# EAGLE design slave (EAGLE 9.5.1)
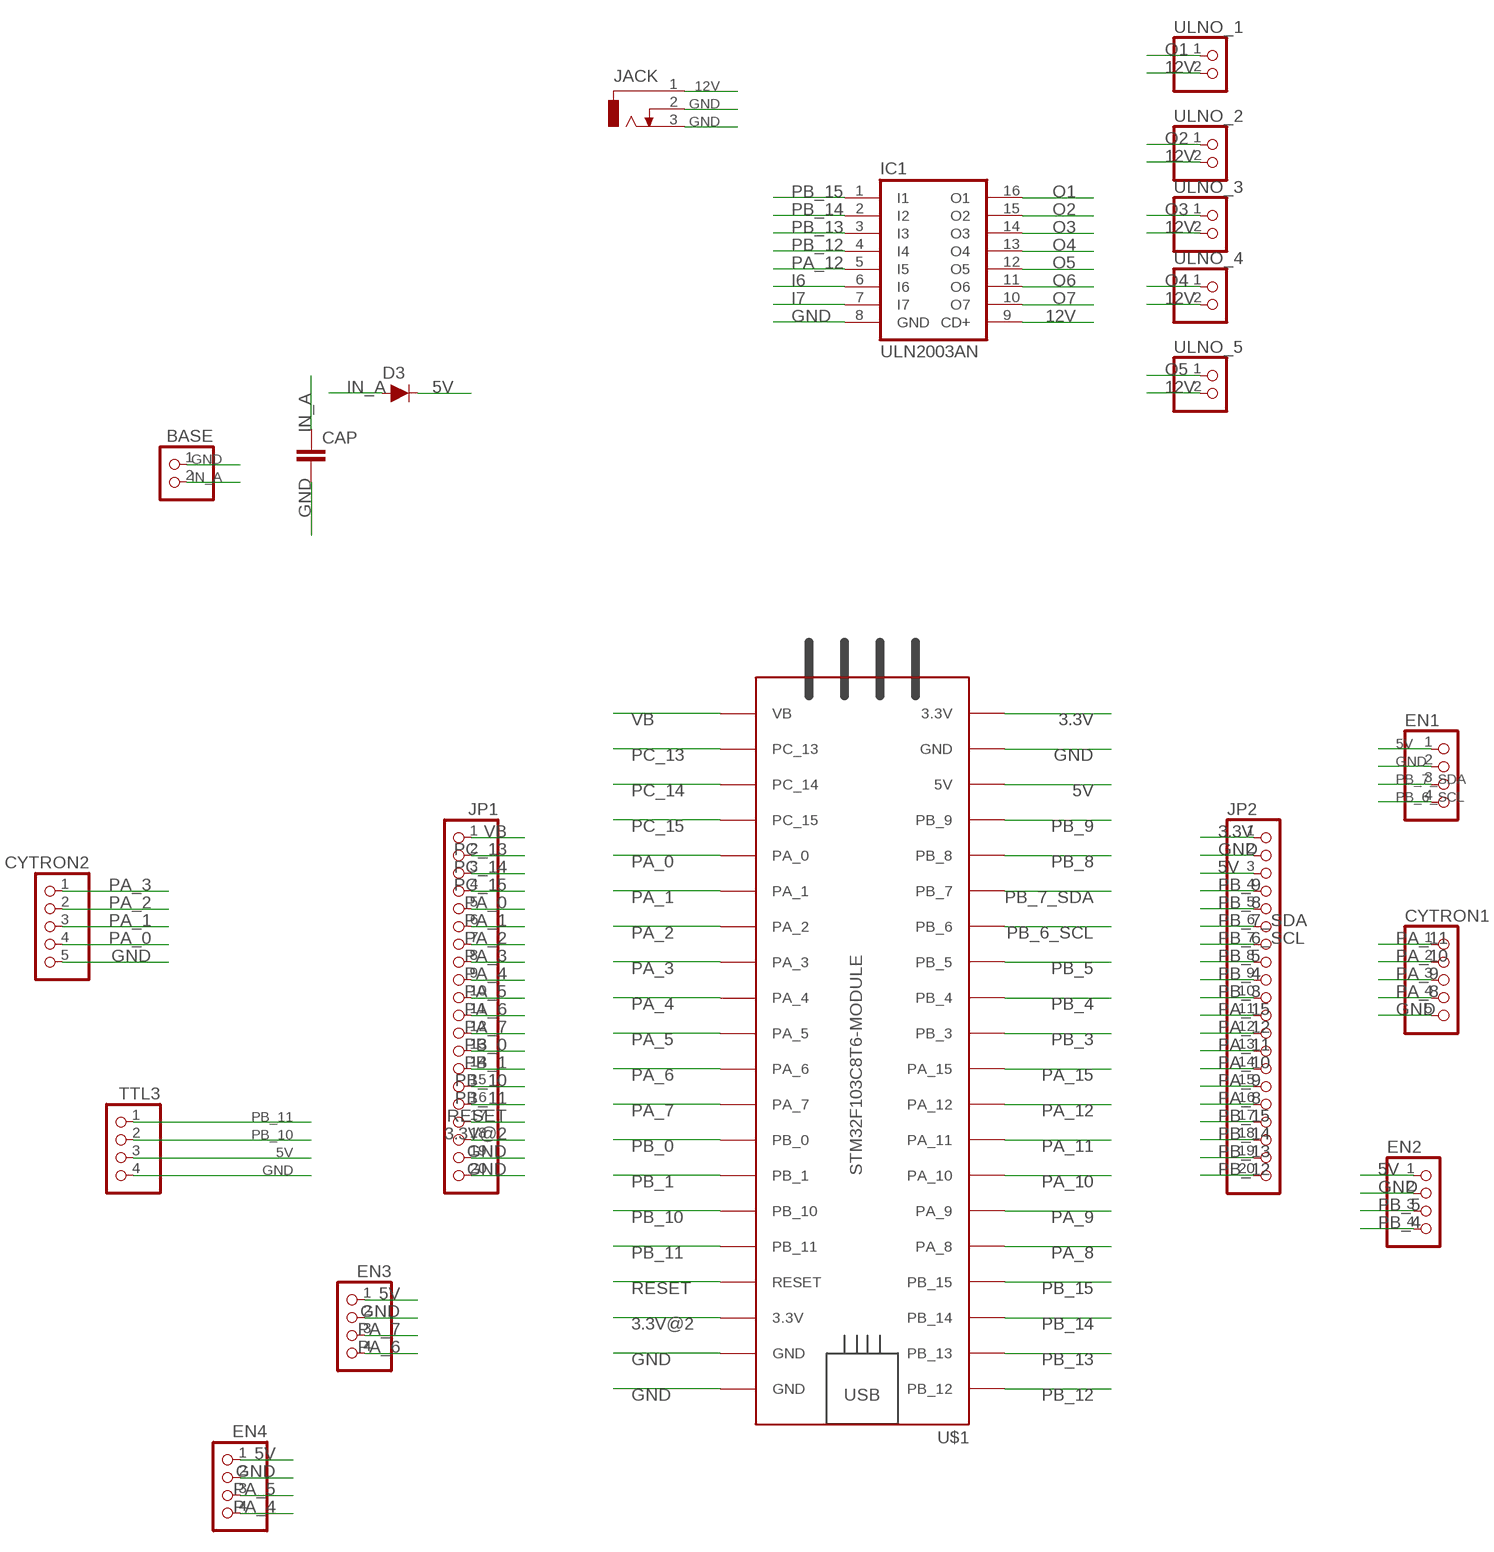
[diagram p0: schematic, sheet 1]

## Parts
BASE  PINHD-2_DATA  [1X02_DATA]
CAP  CAPACITOR  [C025-025X050]
CYTRON1  PINHD-5_DATA  [1X05_DATA]
CYTRON2  PINHD-5_DATA  [1X05_DATA]
D3  200mA/100V/1V  DIODE(1A)-1N4148  [DIODE-1N4148]
EN1  PINHD-4_DATA  [1X04_DATA]
EN2  PINHD-4_DATA  [1X04_DATA]
EN3  PINHD-4_DATA  [1X04_DATA]
EN4  PINHD-4_DATA  [1X04_DATA]
IC1  ULN2003AN  [DIL16]
JACK  CON_JACK  [DCJ0303]
JP1  PINHD-1X20  [1X20]
JP2  PINHD-1X20  [1X20]
TTL3  PINHD-4_DATA  [1X04_DATA]
U$1  STM32F103C8T6-MODULE  [STM32F103C8T6-MODULE]
ULNO_1  PINHD-2_DATA  [1X02_DATA]
ULNO_2  PINHD-2_DATA  [1X02_DATA]
ULNO_3  PINHD-2_DATA  [1X02_DATA]
ULNO_4  PINHD-2_DATA  [1X02_DATA]
ULNO_5  PINHD-2_DATA  [1X02_DATA]

## Nets
3.3V: JP2.1 U$1.3.3V_1(3.3V)
3.3V@2: JP1.18 U$1.3.3V_2(3.3V)
5V: D3.C EN1.1 EN2.1 EN3.1 EN4.1 JP2.3 TTL3.3 U$1.5V
12V: IC1.9(CD+) JACK.1 ULNO_1.2 ULNO_2.2 ULNO_3.2 ULNO_4.2 ULNO_5.2
GND: BASE.1 CAP.2 CYTRON1.5 CYTRON2.5 EN1.2 EN2.2 EN3.2 EN4.2 IC1.8(GND) JACK.2 JACK.3 JP1.19 JP1.20 JP2.2 TTL3.4 U$1.GND_1(GND) U$1.GND_2(GND) U$1.GND_3(GND)
I6: IC1.6(I6)
I7: IC1.7(I7)
IN_A: BASE.2 CAP.1 D3.A
O1: IC1.16(O1) ULNO_1.1
O2: IC1.15(O2) ULNO_2.1
O3: IC1.14(O3) ULNO_3.1
O4: IC1.13(O4) ULNO_4.1
O5: IC1.12(O5) ULNO_5.1
O6: IC1.11(O6)
O7: IC1.10(O7)
PA_0: CYTRON2.4 JP1.5 U$1.PA_0
PA_1: CYTRON2.3 JP1.6 U$1.PA_1
PA_2: CYTRON2.2 JP1.7 U$1.PA_2
PA_3: CYTRON2.1 JP1.8 U$1.PA_3
PA_4: EN4.4 JP1.9 U$1.PA_4
PA_5: EN4.3 JP1.10 U$1.PA_5
PA_6: EN3.4 JP1.11 U$1.PA_6
PA_7: EN3.3 JP1.12 U$1.PA_7
PA_8: CYTRON1.4 JP2.16 U$1.PA_8
PA_9: CYTRON1.3 JP2.15 U$1.PA_9
PA_10: CYTRON1.2 JP2.14 U$1.PA_10
PA_11: CYTRON1.1 JP2.13 U$1.PA_11
PA_12: IC1.5(I5) JP2.12 U$1.PA_12
PA_15: JP2.11 U$1.PA_15
PB_0: JP1.13 U$1.PB_0
PB_1: JP1.14 U$1.PB_1
PB_3: JP2.10 U$1.PB_3
PB_4: EN2.4 JP2.9 U$1.PB_4
PB_5: EN2.3 JP2.8 U$1.PB_5
PB_6_SCL: EN1.4 JP2.7 U$1.PB_6
PB_7_SDA: EN1.3 JP2.6 U$1.PB_7
PB_8: JP2.5 U$1.PB_8
PB_9: JP2.4 U$1.PB_9
PB_10: JP1.15 TTL3.2 U$1.PB_10
PB_11: JP1.16 TTL3.1 U$1.PB_11
PB_12: IC1.4(I4) JP2.20 U$1.PB_12
PB_13: IC1.3(I3) JP2.19 U$1.PB_13
PB_14: IC1.2(I2) JP2.18 U$1.PB_14
PB_15: IC1.1(I1) JP2.17 U$1.PB_15
PC_13: JP1.2 U$1.PC_13
PC_14: JP1.3 U$1.PC_14
PC_15: JP1.4 U$1.PC_15
RESET: JP1.17 U$1.RESET
VB: JP1.1 U$1.VB

## Library data of the parts
BASE ULNO_1-ULNO_5 = MIA_LIBRARY-2-2-2:PINHD-2_DATA: PIN HEADER
CAP = MIA_LIBRARY-2-2-2:CAPACITOR
CYTRON1 CYTRON2 = MIA_LIBRARY-2-2-2:PINHD-5_DATA: PIN HEADER
D3 = MIA_LIBRARY-2-2-2:DIODE(1A): Diode These are standard reverse protection diodes and small signal diodes. SparkFun Products: SparkFun SparkPunk Sound Kit <https://www.sparkfun.com/products/11177> SparkFun ESP8266 Thing <https://www.sparkfun.com/products/13231>; PROD_ID: DIO-08378
EN1-EN4 TTL3 = MIA_LIBRARY-2-2-2:PINHD-4_DATA: PIN HEADER
IC1 = MIA_LIBRARY-2-2-2:ULN2003A: DRIVER ARRAY
JACK = MIA_LIBRARY-2-2-2:CON_JACK: DC POWER JACK Source: DCJ0303.pdf; OC_FARNELL: unknown; OC_NEWARK: unknown
JP1 JP2 = MIA_LIBRARY-2-2-2:PINHD-1X20: PIN HEADER
U$1 = MIA_LIBRARY-2-2-2:STM32F103C8T6-MODULE: STM32F103C8T6 module with ARM Cortex-3, 20kB SRAM, 64kB Flash, 72MHz

## Board
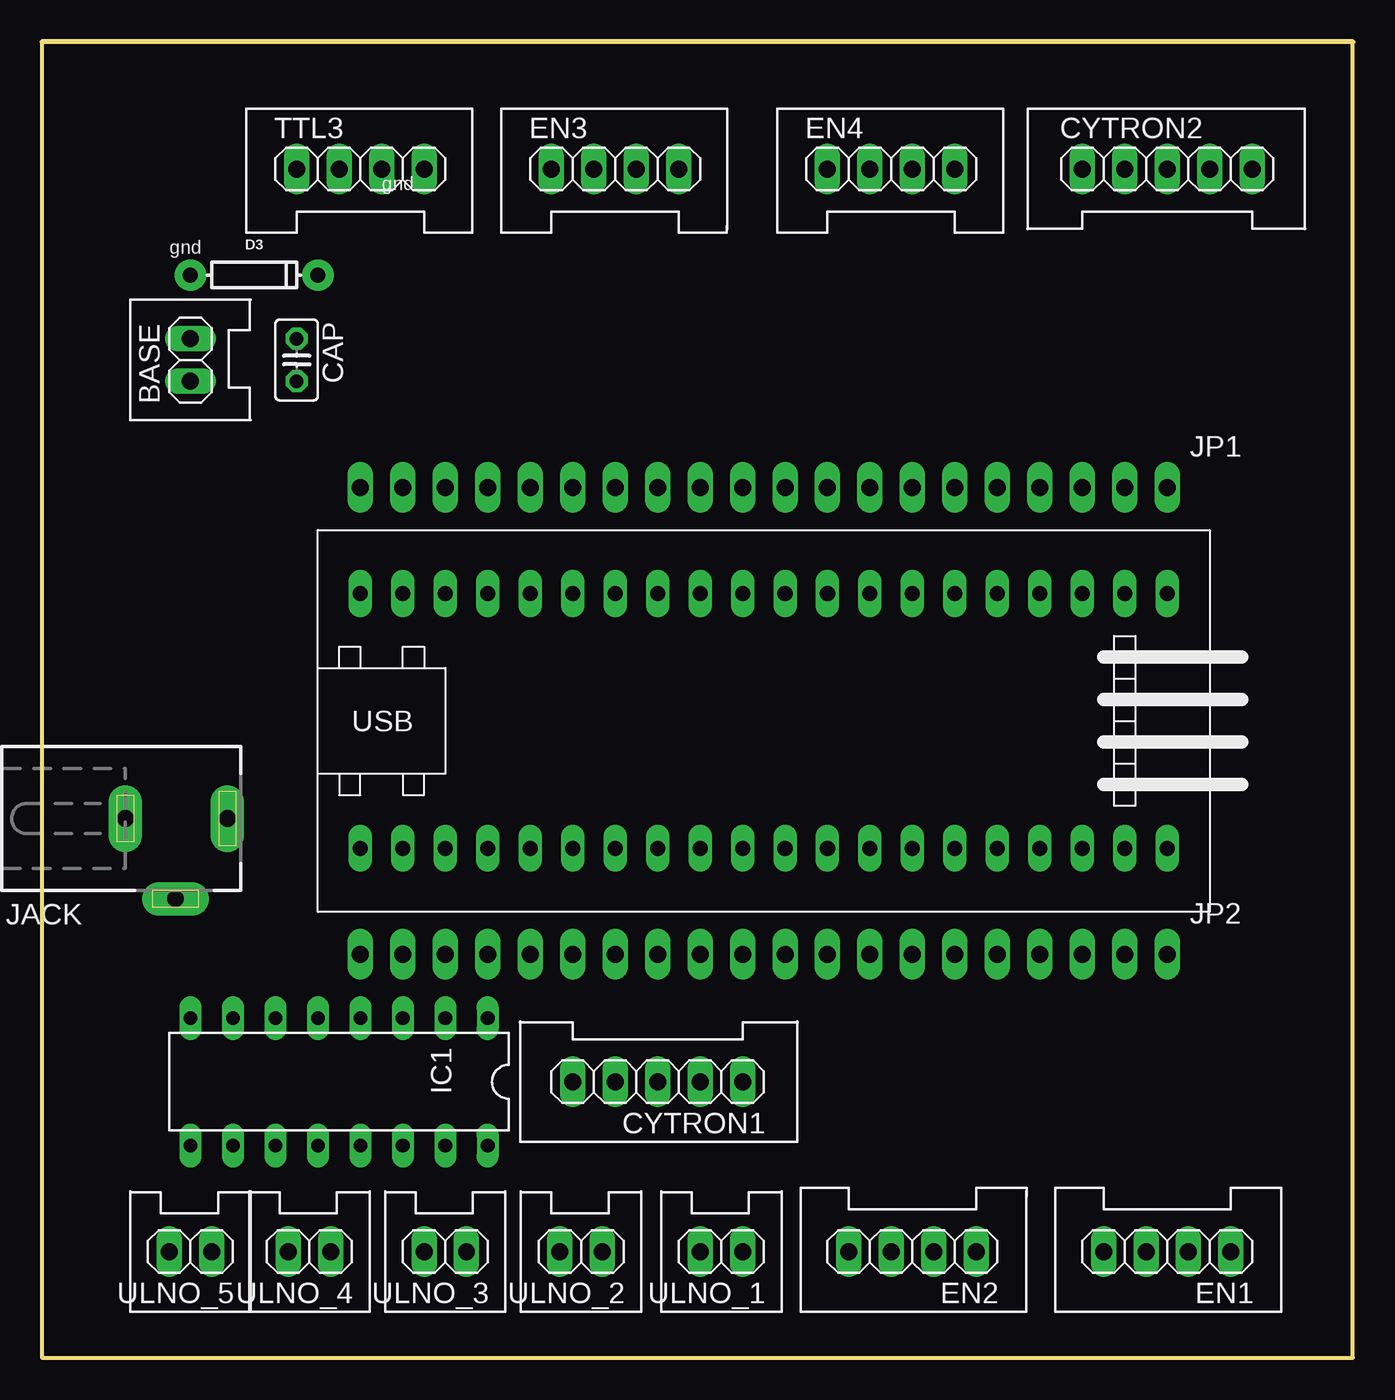
[diagram p1: board, top side]
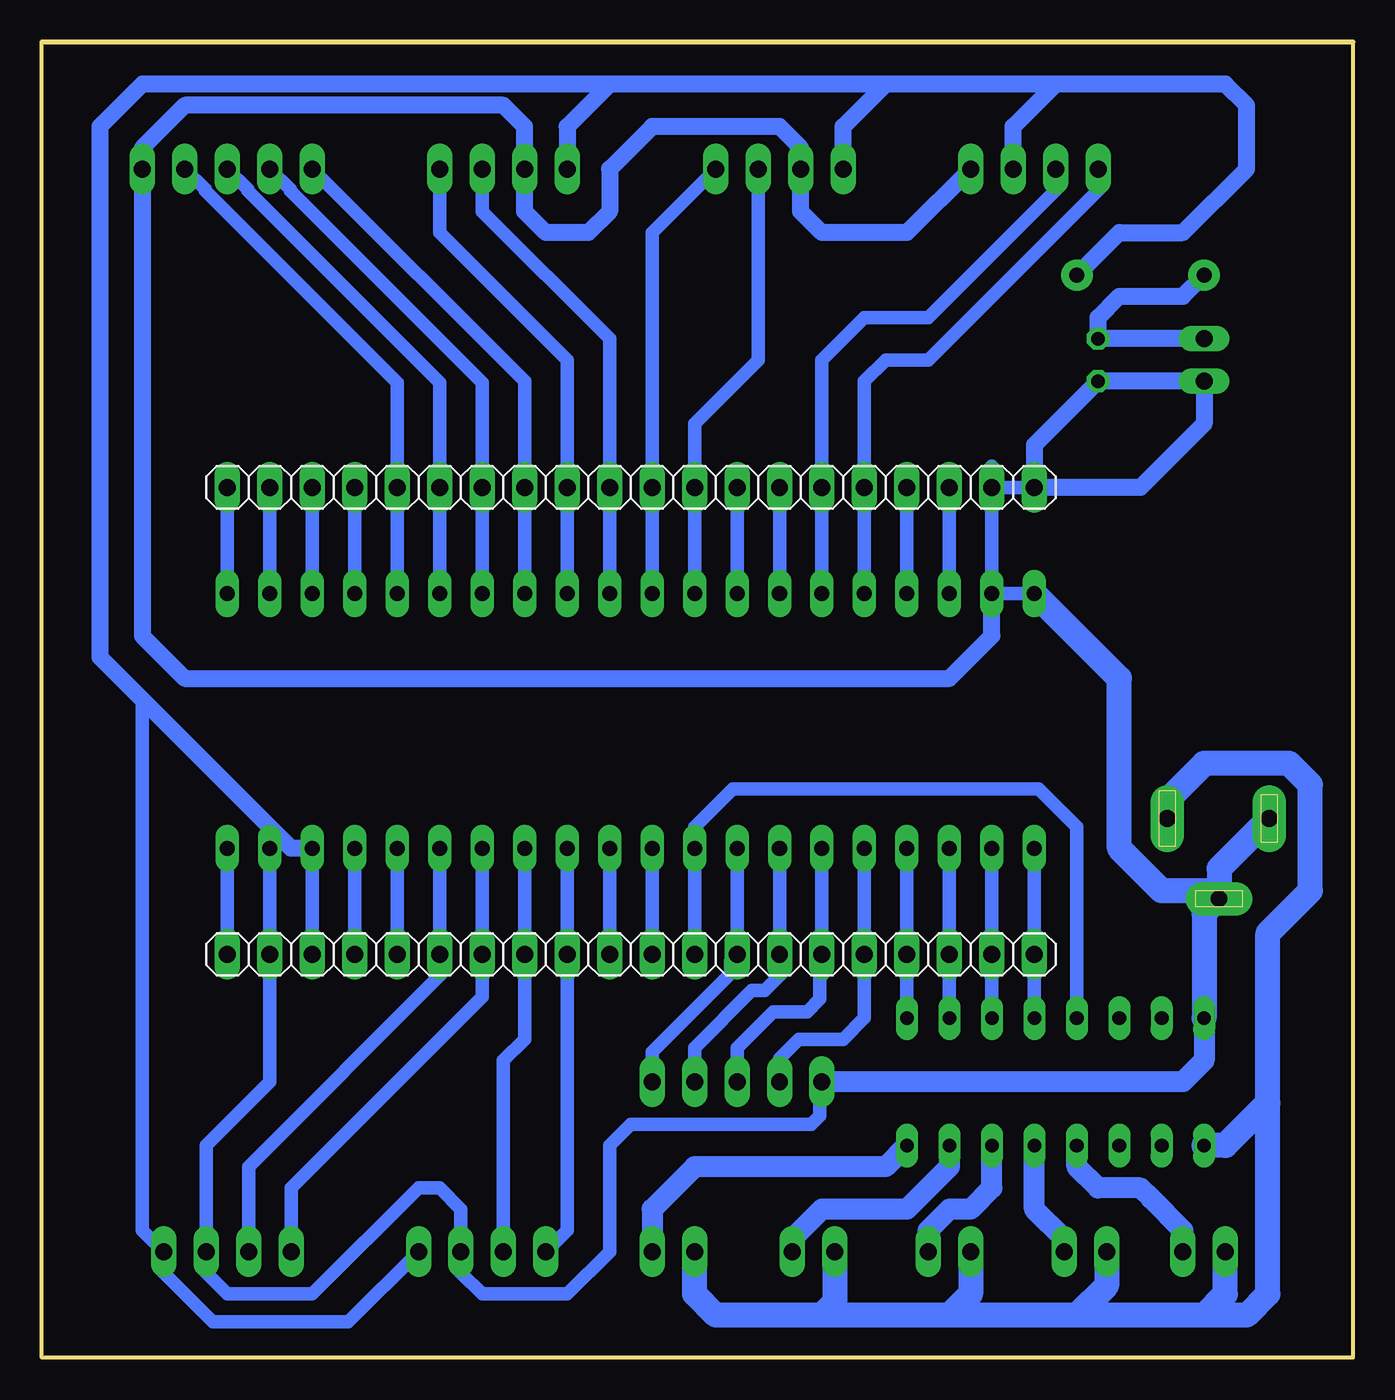
[diagram p2: board, bottom side, seen from below]

Size 78.41 x 78.73 mm. Coordinates in mm from the lower left corner, seen from the top.
Outline: 0,0 78.41,0 78.41,78.73 0,78.73 0,0
Copper layers (1*16): Top 0.035mm / dielectric 1.5mm / Bottom 0.035mm
Design rules "default": minimum track width 6mil, minimum drill 0.35mm, track to track 6mil, track to pad 6mil, pad to pad 6mil, via to via 6mil, smd to smd 6mil, copper to edge 40mil, drill to drill 6mil, minimum pad ring 10mil, minimum via ring 8mil, stop-mask expansion 4mil, vias tented up to drill 0mil, thermal gap 10mil

### Footprints (pad centres in the part's own frame; a part is rotated, then mirrored left to right if it is on the bottom)
1X02_DATA = drill 1.016 long: 1 -1.27,0; 2 1.27,0
C025-025X050 = drill 0.813 octagon: 1 -1.27,0; 2 1.27,0
1X05_DATA = drill 1.016 long: 1 -5.08,0; 2 -2.54,0; 3 0,0; 4 2.54,0; 5 5.08,0
DIODE-1N4148 = drill 0.9 pad 1.88: A -3.81,0; C 3.81,0
1X04_DATA = drill 1.016 long: 1 -3.81,0; 2 -1.27,0; 3 1.27,0; 4 3.81,0
DIL16 = drill 0.813 long: 1 -8.89,-3.81; 2 -6.35,-3.81; 3 -3.81,-3.81; 4 -1.27,-3.81; 5 1.27,-3.81; 6 3.81,-3.81; 7 6.35,-3.81; 8 8.89,-3.81; 9 8.89,3.81; 10 6.35,3.81; 11 3.81,3.81; 12 1.27,3.81; 13 -1.27,3.81; 14 -3.81,3.81; 15 -6.35,3.81; 16 -8.89,3.81
DCJ0303 = drill 1 pad 2 long: 1 0,3.1; 2 4.8,0; 3 0,-3
1X20 = drill 1.016 long: 1 -24.13,0; 2 -21.59,0; 3 -19.05,0; 4 -16.51,0; 5 -13.97,0; 6 -11.43,0; 7 -8.89,0; 8 -6.35,0; 9 -3.81,0; 10 -1.27,0; 11 1.27,0; 12 3.81,0; 13 6.35,0; 14 8.89,0; 15 11.43,0; 16 13.97,0; 17 16.51,0; 18 19.05,0; 19 21.59,0; 20 24.13,0
STM32F103C8T6-MODULE = drill 0.9 long: 3.3V_1 25.4,-7.62; 3.3V_2 -17.78,7.62; 5V 20.32,-7.62; GND_1 22.86,-7.62; GND_2 -20.32,7.62; GND_3 -22.86,7.62; PA_0 15.24,7.62; PA_1 12.7,7.62; PA_2 10.16,7.62; PA_3 7.62,7.62; PA_4 5.08,7.62; PA_5 2.54,7.62; PA_6 0,7.62; PA_7 -2.54,7.62; PA_8 -12.7,-7.62; PA_9 -10.16,-7.62; PA_10 -7.62,-7.62; PA_11 -5.08,-7.62; PA_12 -2.54,-7.62; PA_15 0,-7.62; PB_0 -5.08,7.62; PB_1 -7.62,7.62; PB_3 2.54,-7.62; PB_4 5.08,-7.62; PB_5 7.62,-7.62; PB_6 10.16,-7.62; PB_7 12.7,-7.62; PB_8 15.24,-7.62; PB_9 17.78,-7.62; PB_10 -10.16,7.62; PB_11 -12.7,7.62; PB_12 -22.86,-7.62; PB_13 -20.32,-7.62; PB_14 -17.78,-7.62; PB_15 -15.24,-7.62; PC_13 22.86,7.62; PC_14 20.32,7.62; PC_15 17.78,7.62; RESET -15.24,7.62; VB 25.4,7.62

### Placement (x,y rotation side)
BASE  8.89,59.69 90 top
CAP  15.24,59.69 270 top
CYTRON1  36.83,16.51 180 top
CYTRON2  67.31,71.12 0 top
D3  12.7,64.77 0 top
EN1  67.31,6.35 180 top
EN2  52.07,6.35 180 top
EN3  34.29,71.12 0 top
EN4  50.8,71.12 0 top
IC1  17.78,16.51 180 top
JACK  8,32.26 270 top
JP1  43.18,52.07 0 bottom
JP2  43.18,24.13 0 bottom
TTL3  19.05,71.12 0 top
U$1  41.91,38.1 0 top
ULNO_1  40.64,6.35 180 top
ULNO_2  32.26,6.35 180 top
ULNO_3  24.13,6.35 180 top
ULNO_4  16,6.35 180 top
ULNO_5  8.89,6.35 180 top

### Tracks (layer width: path | path; a pad name or v marks a point on that pad's centre or on a via)
3.3V
  Bottom 0.813: U$1.3.3V_1 JP2.1
3.3V@2
  Bottom 0.813: U$1.3.3V_2 JP1.18
5V
  Bottom 0.813: U$1.5V JP2.3 | EN2.1 60.07,2.16 68.2,2.16 71.12,5.08 EN1.1 72.39,7.62 72.39,39.37
  Bottom 1.016: 44.45,76.2 46.99,73.66 EN4.1 | D3.C 13.97,67.31 10.16,67.31 6.35,71.12 6.35,74.93 7.62,76.2 17.78,76.2 | 17.78,76.2 27.94,76.2 | 27.94,76.2 44.45,76.2 | TTL3.3 20.32,73.66 17.78,76.2 | EN3.1 30.48,73.66 27.94,76.2 | 44.45,76.2 72.39,76.2 74.93,73.66 74.93,41.91 72.39,39.37 63.5,30.48 U$1.5V
12V
  Bottom 1.5: 5.08,15.24 7.62,12.7 IC1.9 | 5.08,15.24 5.08,3.81 6.35,2.54 8.89,2.54 | 8.89,2.54 16.51,2.54 | 16.51,2.54 24.13,2.54 | 24.13,2.54 31.75,2.54 | 31.75,2.54 38.1,2.54 39.37,3.81 ULNO_1.2 | 8.89,2.54 7.62,3.81 ULNO_5.2 | ULNO_4.2 14.73,4.32 16.51,2.54 | ULNO_3.2 22.86,3.81 24.13,2.54 | ULNO_2.2 30.99,3.3 31.75,2.54 | JACK.1 11.1,33.35 8.89,35.56 3.81,35.56 2.54,34.29 2.54,27.94 5.08,25.4 5.08,15.24
GND
  Bottom 0.813: U$1.GND_1 JP2.2 64.77,16.51 68.58,12.7 EN1.2 68.58,5.08 67.31,3.81 62.23,3.81 55.88,10.16 54.61,10.16 53.34,8.89 EN2.2 53.34,5.08 52.07,3.81 46.99,3.81 44.45,6.35 44.45,12.7 43.18,13.97 32.38,13.97 31.88,14.48 31.88,16.38 CYTRON1.5 | U$1.GND_3 U$1.GND_2 JP1.19 | JP1.19 JP1.20 | JP1.19 21.59,53.34
  Bottom 1.016: TTL3.4 26.67,67.31 31.75,67.31 33.02,68.58 EN3.2 33.02,72.39 34.29,73.66 41.91,73.66 44.45,71.12 44.45,68.58 45.72,67.31 48.26,67.31 49.53,68.58 EN4.2 49.53,73.66 50.8,74.93 69.85,74.93 72.39,72.39 CYTRON2.5 72.39,43.18 69.85,40.64 24.13,40.64 21.59,43.18 U$1.GND_2 | BASE.1 8.89,55.88 12.7,52.07 JP1.20 19.05,54.61 CAP.2 BASE.1
  Bottom 1.27: IC1.8 8.89,17.78 10.16,16.51 CYTRON1.5
  Bottom 1.5: JACK.3 8,29.26 JACK.2 | JACK.2 8.89,26.57 IC1.8 | JACK.2 8.48,27.94 11.43,27.94 13.97,30.48 13.97,40.64 U$1.GND_3
IN_A
  Bottom 1.016: BASE.2 CAP.1 15.24,62.23 13.97,63.5 10.16,63.5 D3.A
O1
  Bottom 1.27: IC1.16 27.94,11.43 39.37,11.43 41.91,8.89 ULNO_1.1
O2
  Bottom 1.27: IC1.15 24.13,11.43 26.67,8.89 31.75,8.89 33.53,7.11 ULNO_2.1
O3
  Bottom 1.27: IC1.14 21.59,10.16 22.86,8.89 24.13,8.89 25.4,7.62 ULNO_3.1
O4
  Bottom 1.27: ULNO_4.1 17.27,7.11 19.05,8.89 IC1.13
O5
  Bottom 1.27: ULNO_5.1 10.16,7.62 12.07,9.52 12.7,10.16 15.24,10.16 16.51,11.43 IC1.12
PA_0
  Bottom 0.813: U$1.PA_0 JP1.5 57.15,58.33 68.63,69.81 68.63,69.9 CYTRON2.4
PA_1
  Bottom 0.813: U$1.PA_1 JP1.6 54.61,58.33 66.09,69.81 66.09,69.9 CYTRON2.3
PA_2
  Bottom 0.813: U$1.PA_2 JP1.7 52.07,58.33 63.55,69.81 63.55,69.9 CYTRON2.2
PA_3
  Bottom 0.813: U$1.PA_3 JP1.8 49.53,58.42 CYTRON2.1
PA_4
  Bottom 0.813: U$1.PA_4 JP1.9 46.99,59.69 54.61,67.31 EN4.4
PA_5
  Bottom 0.813: U$1.PA_5 JP1.10 44.45,60.96 52.07,68.58 EN4.3
PA_6
  Bottom 0.813: U$1.PA_6 JP1.11 41.91,67.31 EN3.4
PA_7
  Bottom 0.813: U$1.PA_7 JP1.12 39.37,55.88 35.56,59.69 EN3.3
PA_8
  Bottom 0.813: U$1.PA_8 JP2.16 29.21,20.32 30.48,19.05 33.15,19.05 34.29,17.91 CYTRON1.4
PA_9
  Bottom 0.813: U$1.PA_9 JP2.15 | 31.75,22.86 JP2.15 | JP2.15 31.88,24 31.88,21.46 32.64,20.7 34.67,20.7 36.83,18.54 CYTRON1.3
PA_10
  Bottom 0.813: U$1.PA_10 JP2.14 34.29,22.86 35.18,21.97 35.94,21.97 39.37,18.54 CYTRON1.2
PA_11
  Bottom 0.813: U$1.PA_11 JP2.13 37.21,23.75 37.21,22.99 40.89,19.3 41.15,19.05 41.91,18.29 CYTRON1.1
PA_12
  Bottom 0.813: JP2.12 U$1.PA_12 39.37,31.75 37.08,34.04 21.08,34.04 20.32,34.04 18.8,34.04 16.51,31.75 IC1.5
PA_15
  Bottom 0.813: U$1.PA_15 JP2.11
PB_0
  Bottom 0.813: U$1.PB_0 JP1.13
PB_1
  Bottom 0.813: U$1.PB_1 JP1.14
PB_3
  Bottom 0.813: U$1.PB_3 JP2.10
PB_4
  Bottom 0.813: U$1.PB_4 JP2.9 46.99,7.62 EN2.4
PB_5
  Bottom 0.813: U$1.PB_5 JP2.8 49.53,19.05 50.8,17.78 EN2.3
PB_6_SCL
  Bottom 0.813: U$1.PB_6 JP2.7 52.07,21.59 63.5,10.16 EN1.4
PB_7_SDA
  Bottom 0.813: U$1.PB_7 JP2.6 54.61,22.86 66.04,11.43 EN1.3
PB_8
  Bottom 0.813: U$1.PB_8 JP2.5
PB_9
  Bottom 0.813: U$1.PB_9 JP2.4
PB_10
  Bottom 0.813: U$1.PB_10 JP1.15 31.75,59.69 29.21,62.23 25.4,62.23 17.78,69.85 TTL3.2
PB_11
  Bottom 0.813: U$1.PB_11 JP1.16 29.21,58.42 27.94,59.69 25.4,59.69 15.24,69.85 TTL3.1
PB_12
  Bottom 0.813: U$1.PB_12 JP2.20 IC1.4
PB_13
  Bottom 0.813: U$1.PB_13 JP2.19 IC1.3
PB_14
  Bottom 0.813: U$1.PB_14 JP2.18 IC1.2
PB_15
  Bottom 0.813: U$1.PB_15 JP2.17 IC1.1
PC_13
  Bottom 0.813: U$1.PC_13 JP1.2
PC_14
  Bottom 0.813: U$1.PC_14 JP1.3
PC_15
  Bottom 0.813: U$1.PC_15 JP1.4
RESET
  Bottom 0.813: U$1.RESET JP1.17
VB
  Bottom 0.813: U$1.VB JP1.1

### Text on the board
tNames: gnd | gnd